# EAGLE schematic lab_fisica (EAGLE 9.6.2)
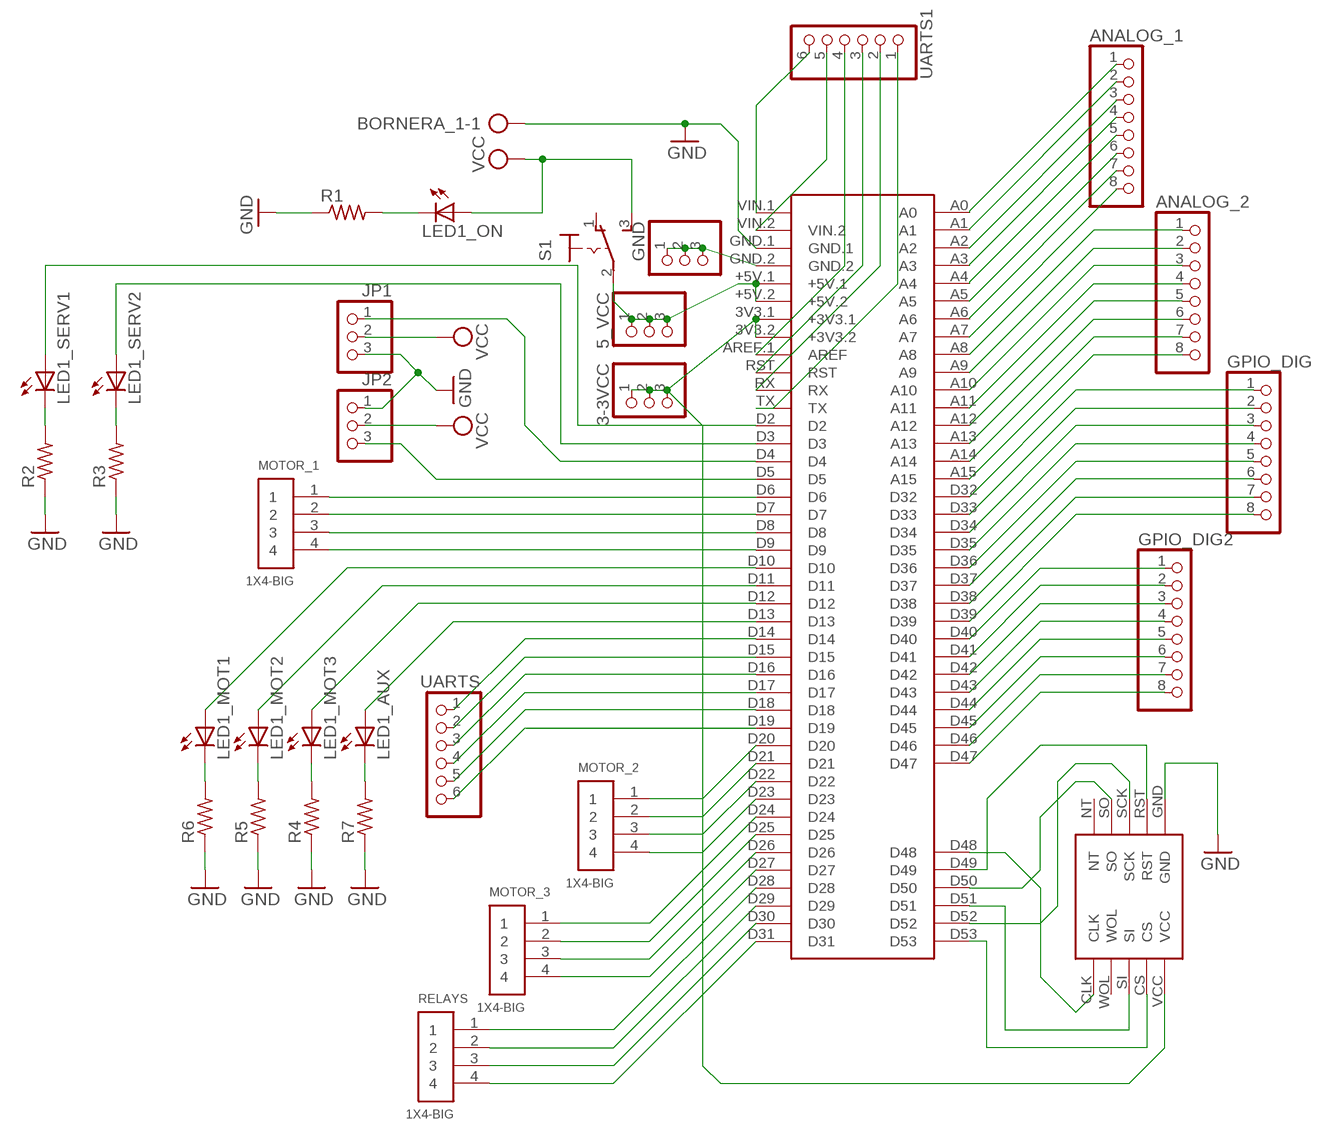
[diagram p0: schematic, sheet 1]

## Parts
3-3VCC  PINHD-1X3  [1X03]
5_VCC  PINHD-1X3  [1X03]
ANALOG_1  PINHD-1X8BIG  [1X08-BIG]
ANALOG_2  PINHD-1X8BIG  [1X08-BIG]
BORNERA_1  AK300/2  [AK300/2]
GND  PINHD-1X3  [1X03]
GPIO_DIG  PINHD-1X8BIG  [1X08-BIG]
GPIO_DIG2  PINHD-1X8BIG  [1X08-BIG]
JP1  PINHD-1X3  [1X03]
JP2  PINHD-1X3  [1X03]
LED1_AUX  LED5MM  [LED5MM]
LED1_MOT1  LED5MM  [LED5MM]
LED1_MOT2  LED5MM  [LED5MM]
LED1_MOT3  LED5MM  [LED5MM]
LED1_ON  LED5MM  [LED5MM]
LED1_SERV1  LED5MM  [LED5MM]
LED1_SERV2  LED5MM  [LED5MM]
MODULO_ETHERNET  ENC28J60  [ENC28J60]
MOTOR_1  1X4-BIG  [1X04-BIG]
MOTOR_2  1X4-BIG  [1X04-BIG]
MOTOR_3  1X4-BIG  [1X04-BIG]
R1  R-US_R0805  [R0805]
R2  R-US_R0805  [R0805]
R3  R-US_R0805  [R0805]
R4  R-US_R0805  [R0805]
R5  R-US_R0805  [R0805]
R6  R-US_R0805  [R0805]
R7  R-US_R0805  [R0805]
RELAYS  1X4-BIG  [1X04-BIG]
S1  320-916  [320-916]
U$1  MEGA2560_MIKRO  [MEGA2560_MIKRO]
UARTS  PINHD-1X6B  [1X06-BIG]
UARTS1  PINHD-1X6B  [1X06-BIG]

## Nets
GND: BORNERA_1.1 JP1.3 JP2.1 MODULO_ETHERNET.GND R1.1 R2.1 R3.1 R4.1 R5.1 R6.1 R7.1 U$1.GND.1
N$1: MODULO_ETHERNET.SO U$1.D50
N$2: MODULO_ETHERNET.SI U$1.D51
N$3: MODULO_ETHERNET.CS U$1.D53
N$4: MODULO_ETHERNET.SCK U$1.D52
N$5: GND.1 GND.2 GND.3 U$1.GND.2
N$6: JP2.3 U$1.D5
N$7: JP1.1 U$1.D4
N$8: MOTOR_1.1 U$1.D6
N$9: MOTOR_1.2 U$1.D7
N$10: MOTOR_1.3 U$1.D8
N$11: MOTOR_1.4 U$1.D9
N$12: MOTOR_2.4 U$1.D23
N$13: MOTOR_2.3 U$1.D22
N$14: MOTOR_2.2 U$1.D21
N$15: MOTOR_2.1 U$1.D20
N$16: MOTOR_3.1 U$1.D24
N$17: MOTOR_3.2 U$1.D25
N$18: MOTOR_3.3 U$1.D26
N$19: MOTOR_3.4 U$1.D27
N$20: LED1_ON.K(C) R1.2
N$21: LED1_SERV1.K(C) R2.2
N$22: LED1_SERV2.K(C) R3.2
N$23: LED1_MOT3.K(C) R4.2
N$24: LED1_MOT2.K(C) R5.2
N$25: LED1_MOT1.K(C) R6.2
N$26: U$1.D19 UARTS.6
N$27: U$1.D18 UARTS.5
N$28: U$1.D17 UARTS.4
N$29: LED1_SERV2.A U$1.D3
N$30: LED1_SERV1.A U$1.D2
N$31: U$1.D16 UARTS.3
N$32: U$1.D15 UARTS.2
N$33: U$1.D14 UARTS.1
N$34: LED1_AUX.A U$1.D13
N$35: LED1_MOT3.A U$1.D12
N$36: LED1_MOT2.A U$1.D11
N$37: LED1_AUX.K(C) R7.2
N$38: LED1_MOT1.A U$1.D10
N$39: RELAYS.1 U$1.D28
N$40: RELAYS.2 U$1.D29
N$41: RELAYS.3 U$1.D30
N$42: RELAYS.4 U$1.D31
N$43: 5_VCC.1 5_VCC.2 5_VCC.3 S1.2(P) U$1.+5V.1 U$1.+5V.2
N$44: 3-3VCC.1 3-3VCC.2 3-3VCC.3 MODULO_ETHERNET.VCC U$1.3V3.1(+3V3.1) U$1.3V3.2(+3V3.2)
N$45: U$1.TX UARTS1.1
N$46: U$1.RX UARTS1.2
N$47: U$1.RST UARTS1.3
N$48: U$1.AREF.1(AREF) UARTS1.4
N$49: U$1.VIN.2 UARTS1.5
N$50: U$1.VIN.1 UARTS1.6
N$51: MODULO_ETHERNET.RST U$1.D49
N$52: MODULO_ETHERNET.CLK U$1.D48
N$53: ANALOG_1.1 U$1.A0
N$54: ANALOG_1.2 U$1.A1
N$55: ANALOG_1.3 U$1.A2
N$56: ANALOG_1.4 U$1.A3
N$57: ANALOG_1.5 U$1.A4
N$58: ANALOG_1.6 U$1.A5
N$59: ANALOG_1.7 U$1.A6
N$60: ANALOG_1.8 U$1.A7
N$61: ANALOG_2.1 U$1.A8
N$62: ANALOG_2.2 U$1.A9
N$63: ANALOG_2.3 U$1.A10
N$64: ANALOG_2.4 U$1.A11
N$65: ANALOG_2.5 U$1.A12
N$66: ANALOG_2.6 U$1.A13
N$67: ANALOG_2.7 U$1.A14
N$68: ANALOG_2.8 U$1.A15
N$69: GPIO_DIG.1 U$1.D32
N$70: GPIO_DIG.2 U$1.D33
N$71: GPIO_DIG.3 U$1.D34
N$72: GPIO_DIG.4 U$1.D35
N$73: GPIO_DIG.5 U$1.D36
N$74: GPIO_DIG.6 U$1.D37
N$75: GPIO_DIG.7 U$1.D38
N$76: GPIO_DIG.8 U$1.D39
N$77: GPIO_DIG2.1 U$1.D40
N$78: GPIO_DIG2.2 U$1.D41
N$79: GPIO_DIG2.3 U$1.D42
N$80: GPIO_DIG2.4 U$1.D43
N$81: GPIO_DIG2.5 U$1.D44
N$82: GPIO_DIG2.6 U$1.D45
N$83: GPIO_DIG2.7 U$1.D46
N$84: GPIO_DIG2.8 U$1.D47
VCC: JP1.2 JP2.2 LED1_ON.A S1.3(S)
Unconnected: BORNERA_1.2 MODULO_ETHERNET.NT MODULO_ETHERNET.WOL S1.1(O)

## Library data of the parts
3-3VCC 5_VCC GND JP1 JP2 = adafruit:PINHD-1X3: PIN HEADER
ANALOG_1 ANALOG_2 GPIO_DIG GPIO_DIG2 = adafruit:PINHD-1X8: PIN HEADER
BORNERA_1 = con-ptr500:AK300/2: CONNECTOR; OC_FARNELL: unknown; OC_NEWARK: unknown
LED1_AUX LED1_MOT1-LED1_MOT3 LED1_ON LED1_SERV1 LED1_SERV2 = adafruit:LED: LED OSRAM: - CHIPLED LG R971, LG N971, LY N971, LG Q971, LY Q971, LO R971, LY R971 LH N974, LH R974 LS Q976, LO Q976, LY Q976 LO Q996 - Hyper CHIPLED LW Q18S LB Q993, LB Q99A, LB R99A - SideLED LS A670, LO A670, LY A670, LG A670, LP A670 LB A673, LV A673, LT A673, LW A673 LH A674 LY A675 LS A676, LA A676, LO A676, LY A676, LW A676 LS A679, LY A679, LG A679 - Hyper Micro SIDELED® LS Y876, LA Y876, LO Y876, LY Y876 LT Y87S - SmartLED LW L88C, LW L88S LB L89C, LB L89S, LG L890 LS L89K, LO L89K, LY L89K LS L896, LA L896, LO L896, LY L896 - TOPLED LS T670, LO T670, LY T670, LG T670, LP T670 LSG T670, LSP T670, LSY T670, LOP T670, LYG T670 LG T671, LOG T671, LSG T671 LB T673, LV T673, LT T673, LW T673 LH T674 LS T676, LA T676, LO T676, LY T676, LB T676, LH T676, LSB T676, LW T676 LB T67C, LV T67C, LT T67C, LS T67K, LO T67K, LY T67K, LW E67C LS E67B, LA E67B, LO E67B, LY E67B, LB E67C, LV E67C, LT E67C LW T67C LS T679, LY T679, LG T679 LS T770, LO T770, LY T770, LG T770, LP T770 LB T773, LV T773, LT T773, LW T773 LH T774 LS E675, LA E675, LY E675, LS T675 LS T776, LA T776, LO T776, LY T776, LB T776 LHGB T686 LT T68C, LB T68C - Hyper Mini TOPLED® LB M676 - Mini TOPLED Santana® LG M470 LS M47K, LO M47K, LY M47K Source: http://www.osram.convergy.de/
MODULO_ETHERNET = ethernet-mikroavr:ENC28J60: ENC28J60, SHIELD EHTERNET, CREATE BY MIKROAVR.COM
MOTOR_1-MOTOR_3 RELAYS = adafruit:1X4: 4-pin connector
R1-R7 = adafruit:R-US_: RESISTOR, American symbol
S1 = switch:320-916: TOGGLE SWITCH distributor RS Components
U$1 = MIKRO_MEGA2560:MEGA2560_MIKRO: Arduino Mega2560 pro robotDyn, create by mikroavr.com
UARTS UARTS1 = adafruit:PINHD-1X6: PIN HEADER